# Altium schematic sheet IR_LED.SchDoc
size A4; SheetNumber: 3; SheetTotal: 7
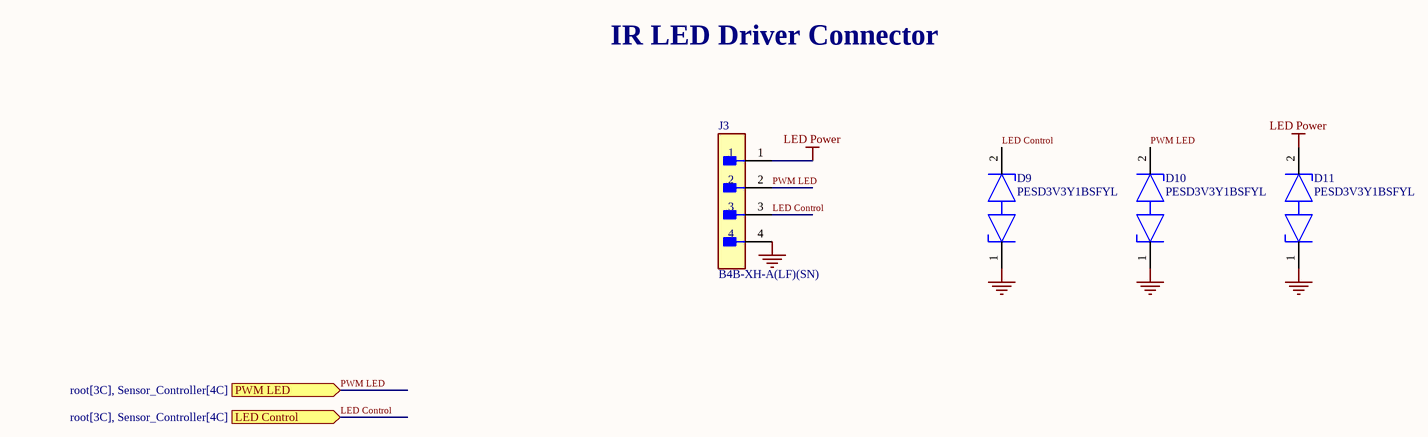
[diagram p0: IR_LED.SchDoc]

## Parts
D9  PESD3V3Y1BSFYL  [FP-SOD962-2-CA-MFG]
D10  PESD3V3Y1BSFYL  [FP-SOD962-2-CA-MFG]
D11  PESD3V3Y1BSFYL  [FP-SOD962-2-CA-MFG]
J3  B4B-XH-A(LF)(SN)  [FP-B4B-XH-A_LF_SN-MFG]

## Ports
LED Control (in, see root[3C], Sensor_Controller[4C]), PWM LED (in, see root[3C], Sensor_Controller[4C])

## Nets
GND: D9.1 D10.1 D11.1 J3.4
LED Power: D11.2 J3.1
LED Control: D9.2 J3.3 ; port LED Control
PWM LED: D10.2 J3.2 ; port PWM LED

## Notes on the sheet
- IR LED Driver Connector

## Library data of the parts
D9-D11 = CMP-11424-92175759-2: PESD3V3Y1BSFYL PESD4V0Y1BSF - Extremely low capacitance bidirectional ESD protection diode; Manufacturer Lifecycle Status: RELEASED FOR SUPPLY; Number of Channels: 1; Breakdown Voltage: 4.2V; Clamping Voltage: 3.7V; Capacitance: 240fF; Reverse Standoff Voltage: 3.3V; Height: 320µm; RoHS: Non-Compliant; Ambient Temperature Range High: 125°C; NexarPartId: 92175759; Direction: Bidirectional; Lifecycle Status: Production; Schedule B: 8536300000
J3 = CMP-17439-000250-1: CONN HEADER VERT 4POS 2.5MM; Number of Contacts: 4; Contact Resistance: 20mR; Voltage Rating: 250V; Max Current Rating: 3A; Gender: Male; Wire/Cable Gauge: 22AWG; Mated Stacking Heights: 9.8mm; Insulation Resistance: 1GR; Orientation: Straight; Contact Type: Male Pin; Contact Finish - Mating: TIN; Series: XH; Max Voltage Rating (AC): 250V; Lead Pitch: 2.5mm; Contact Shape: Square; Insulation Color: Natural; Termination: Solder; Lead Free: Lead Free; Voltage Rating (AC): 250V; Number of Rows: 1; Flammability Rating: UL94 V-0; Number of Positions: 4; Max Operating Temperature: 85°C; Package Quantity: 500; Mount: Through Hole; REACH SVHC: No SVHC; Connector Type: Header; Insulation Material: Nylon; Fastening Type: Detent; Min Operating Temperature: -25°C; Housing Color: White; Packaging: Bulk; Contact Plating: Tin; Contact Material: Brass; Max Voltage Rating (DC): 250V; Housing Material: Polyamide; Color: Natural; Material: Polyamide; Pitch: 2.5mm; Depth: 5.75mm; Current Rating: 3A; Length: 12.4mm